# Altium schematic sheet Digital_DSP.SchDoc
size 508 x 241 mm
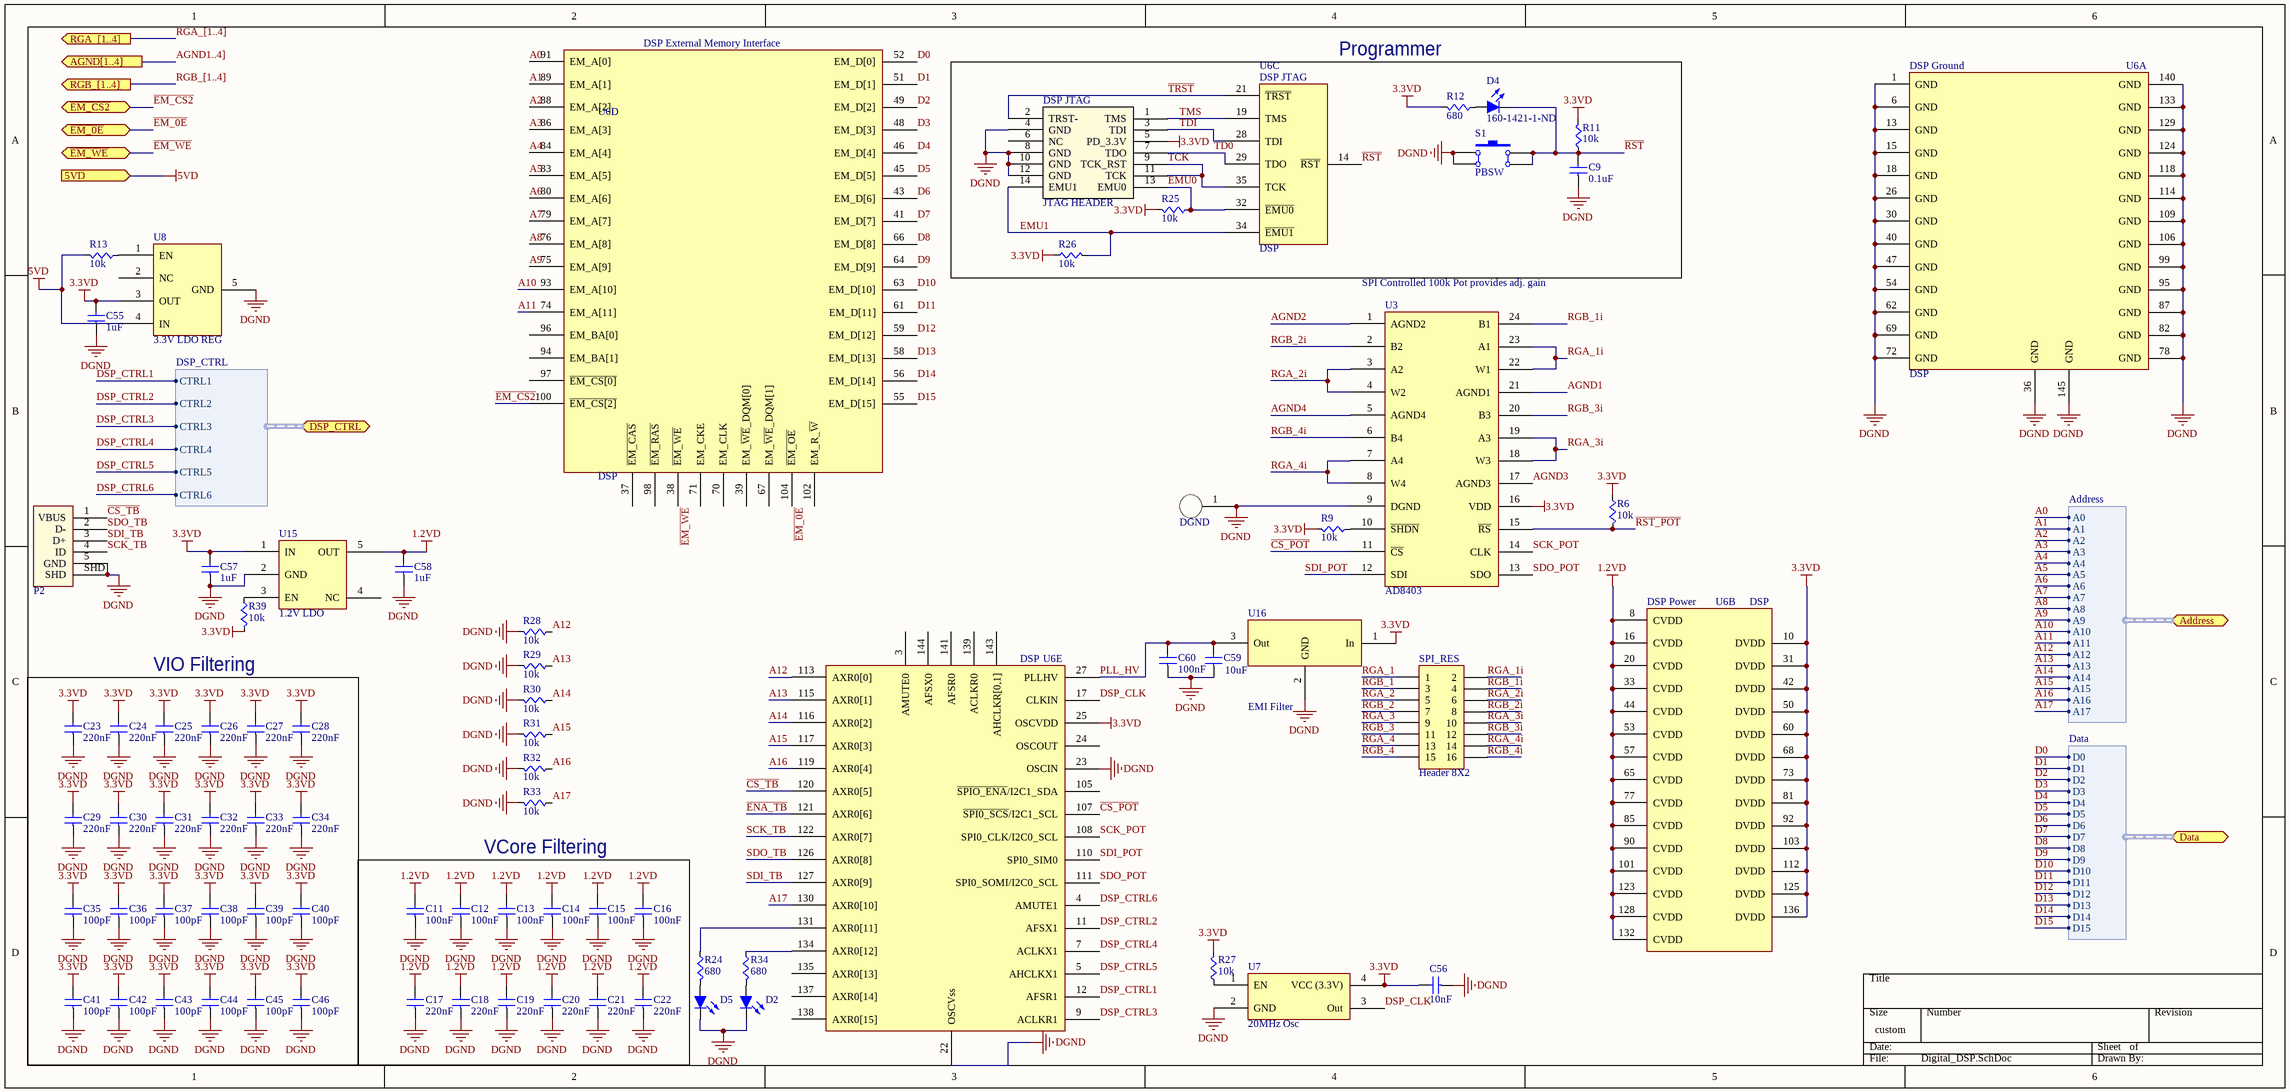
[diagram p0: Digital_DSP.SchDoc]

## Parts
C9  value 0.1uF  [CAPC0603]  (hidden comment: Cap)
C11  value 100nF  [CAPC0603]  (hidden comment: Cap)
C12  value 100nF  [CAPC0603]  (hidden comment: Cap)
C13  value 100nF  [CAPC0603]  (hidden comment: Cap)
C14  value 100nF  [CAPC0603]  (hidden comment: Cap)
C15  value 100nF  [CAPC0603]  (hidden comment: Cap)
C16  value 100nF  [CAPC0603]  (hidden comment: Cap)
C17  value 220nF  [CAPC0603]  (hidden comment: Cap)
C18  value 220nF  [CAPC0603]  (hidden comment: Cap)
C19  value 220nF  [CAPC0603]  (hidden comment: Cap)
C20  value 220nF  [CAPC0603]  (hidden comment: Cap)
C21  value 220nF  [CAPC0603]  (hidden comment: Cap)
C22  value 220nF  [CAPC0603]  (hidden comment: Cap)
C23  value 220nF  [CAPC0603]  (hidden comment: Cap)
C24  value 220nF  [CAPC0603]  (hidden comment: Cap)
C25  value 220nF  [CAPC0603]  (hidden comment: Cap)
C26  value 220nF  [CAPC0603]  (hidden comment: Cap)
C27  value 220nF  [CAPC0603]  (hidden comment: Cap)
C28  value 220nF  [CAPC0603]  (hidden comment: Cap)
C29  value 220nF  [CAPC0603]  (hidden comment: Cap)
C30  value 220nF  [CAPC0603]  (hidden comment: Cap)
C31  value 220nF  [CAPC0603]  (hidden comment: Cap)
C32  value 220nF  [CAPC0603]  (hidden comment: Cap)
C33  value 220nF  [CAPC0603]  (hidden comment: Cap)
C34  value 220nF  [CAPC0603]  (hidden comment: Cap)
C35  value 100pF  [CAPC0603]  (hidden comment: Cap)
C36  value 100pF  [CAPC0603]  (hidden comment: Cap)
C37  value 100pF  [CAPC0603]  (hidden comment: Cap)
C38  value 100pF  [CAPC0603]  (hidden comment: Cap)
C39  value 100pF  [CAPC0603]  (hidden comment: Cap)
C40  value 100pF  [CAPC0603]  (hidden comment: Cap)
C41  value 100pF  [CAPC0603]  (hidden comment: Cap)
C42  value 100pF  [CAPC0603]  (hidden comment: Cap)
C43  value 100pF  [CAPC0603]  (hidden comment: Cap)
C44  value 100pF  [CAPC0603]  (hidden comment: Cap)
C45  value 100pF  [CAPC0603]  (hidden comment: Cap)
C46  value 100pF  [CAPC0603]  (hidden comment: Cap)
C55  value 1uF  [CAPC0603]  (hidden comment: Cap1206)
C56  value 10nF  [CAPC0603]  (hidden comment: Cap)
C57  value 1uF  [CAPC0603]  (hidden comment: Cap1206)
C58  value 1uF  [CAPC0603]  (hidden comment: Cap1206)
C59  value 10uF  [CAP1210]  (hidden comment: CAP1210)
C60  value 100nF  [CAPC0603]  (hidden comment: Cap)
D2  LED-RED  [LED0805-RED]  (value not drawn)
D4  Supplier Part Number: 160-1421-1-ND  [LED0805-RED]  (hidden comment: LED-RED)
D5  LED-RED  [LED0805-RED]  (value not drawn)
DGND  Test_Point  [TP]  (value not drawn)
DSP_JTAG  JTAG HEADER  [JTAG HEADER - 14]
P2  USB Micro  [10118192-0001LF]  (value not drawn)
R6  value 10k  [RES0603]  (hidden comment: Res)
R9  value 10k  [RES0603]  (hidden comment: Res)
R11  value 10k  [RES0603]  (hidden comment: Res)
R12  value 680  [RES0603]  (hidden comment: Res)
R13  value 10k  [RES0603]  (hidden comment: Res)
R24  value 680  [RES0603]  (hidden comment: Res)
R25  value 10k  [RES0603]  (hidden comment: Res)
R26  value 10k  [RES0603]  (hidden comment: Res)
R27  value 10k  [RES0603]  (hidden comment: Res)
R28  value 10k  [RES0603]  (hidden comment: Res)
R29  value 10k  [RES0603]  (hidden comment: Res)
R30  value 10k  [RES0603]  (hidden comment: Res)
R31  value 10k  [RES0603]  (hidden comment: Res)
R32  value 10k  [RES0603]  (hidden comment: Res)
R33  value 10k  [RES0603]  (hidden comment: Res)
R34  value 680  [RES0603]  (hidden comment: Res)
R39  value 10k  [RES0603]  (hidden comment: Res)
S1  PBSW  [PBSW]
SPI_RES  Header 8X2  [HDR2X8]
U3  AD8403  [SOIC-24n]
U6  DSP  [LQFP_EP-144]  (parts A,B,C,D,E of 5)
U7  20MHz Osc  [4-SMD]
U8  3.3V LDO REG  [SOT223-8N]
U15  1.2V LDO  [sot23-5n]
U16  EMI Filter  [1812]

## Blocks framed on the sheet
Programmer: C9 D4 DSP_JTAG R11 R12 R25 R26 S1 U6
VIO Filtering: C23-C46
VCore Filtering: C11-C22

## Ports
5VD (in), Address (harness Address), AGND[1..4] (out), Data (harness Data), DSP_CTRL (harness DSP_CTRL), RGA_[1..4] (out), RGB_[1..4] (out), ~{EM_0E} (bidir), ~{EM_CS2} (bidir), ~{EM_WE} (bidir)

## Harnesses
DSP_CTRL: CTRL1, CTRL2, CTRL3, CTRL4, CTRL5, CTRL6
Address: A0, A1, A2, A3, A4, A5, A6, A7, A8, A9, A10, A11, A12, A13, A14, A15, A16, A17
Data: D0, D1, D2, D3, D4, D5, D6, D7, D8, D9, D10, D11, D12, D13, D14, D15

## Nets
1: S1.2(A')
1.2VD: C11.1(A) C12.1(A) C13.1(A) C14.1(A) C15.1(A) C16.1(A) C17.1(A) C18.1(A) C19.1(A) C20.1(A) C21.1(A) C22.1(A) C58.1(A) U6.8(CVDD) U6.16(CVDD) U6.20(CVDD) U6.33(CVDD) U6.44(CVDD) U6.53(CVDD) U6.57(CVDD) U6.65(CVDD) U6.77(CVDD) U6.85(CVDD) U6.90(CVDD) U6.101(CVDD) U6.123(CVDD) U6.128(CVDD) U6.132(CVDD) U15.5(OUT)
3: S1.4(B')
3.3VD: C23.1(A) C24.1(A) C25.1(A) C26.1(A) C27.1(A) C28.1(A) C29.1(A) C30.1(A) C31.1(A) C32.1(A) C33.1(A) C34.1(A) C35.1(A) C36.1(A) C37.1(A) C38.1(A) C39.1(A) C40.1(A) C41.1(A) C42.1(A) C43.1(A) C44.1(A) C45.1(A) C46.1(A) C55.1(A) C56.1(A) C57.1(A) DSP_JTAG.5(PD_3.3V) R6.2(B) R9.1(A) R11.1(A) R12.1(A) R25.1(A) R26.2(B) R27.1(A) R39.1(A) U3.16(VDD) U6.10(DVDD) U6.25(OSCVDD) U6.31(DVDD) U6.42(DVDD) U6.50(DVDD) U6.60(DVDD) U6.68(DVDD) U6.73(DVDD) U6.81(DVDD) U6.92(DVDD) U6.103(DVDD) U6.112(DVDD) U6.125(DVDD) U6.136(DVDD) U7.4(VCC_(3.3V)) U8.3(OUT) U15.1(IN) U16.1(In)
5VD: R13.1(A) U8.4(IN) ; port 5VD
DGND: C9.2(B) C11.2(B) C12.2(B) C13.2(B) C14.2(B) C15.2(B) C16.2(B) C17.2(B) C18.2(B) C19.2(B) C20.2(B) C21.2(B) C22.2(B) C23.2(B) C24.2(B) C25.2(B) C26.2(B) C27.2(B) C28.2(B) C29.2(B) C30.2(B) C31.2(B) C32.2(B) C33.2(B) C34.2(B) C35.2(B) C36.2(B) C37.2(B) C38.2(B) C39.2(B) C40.2(B) C41.2(B) C42.2(B) C43.2(B) C44.2(B) C45.2(B) C46.2(B) C55.2(B) C56.2(B) C57.2(B) C58.2(B) C59.2(B) C60.2(B) D2.1(K) D5.1(K) DGND.1 DSP_JTAG.4(GND) DSP_JTAG.8(GND) DSP_JTAG.10(GND) DSP_JTAG.12(GND) P2.5(GND) P2.SHD R28.1(A) R29.1(A) R30.1(A) R31.1(A) R32.1(A) R33.1(A) S1.1(A) S1.2(A') U3.9(DGND) U6.1(GND) U6.6(GND) U6.13(GND) U6.15(GND) U6.18(GND) U6.22(OSCVss) U6.23(OSCIN) U6.26(GND) U6.30(GND) U6.36(GND) U6.40(GND) U6.47(GND) U6.54(GND) U6.62(GND) U6.69(GND) U6.72(GND) U6.78(GND) U6.82(GND) U6.87(GND) U6.95(GND) U6.99(GND) U6.106(GND) U6.109(GND) U6.114(GND) U6.118(GND) U6.124(GND) U6.129(GND) U6.133(GND) U6.140(GND) U6.145(GND) U7.2(GND) U8.5(GND) U15.2(GND) U16.2(GND)
A0: U6.91(EM_A[0]) ; port Address.A0
A1: U6.89(EM_A[1]) ; port Address.A1
A2: U6.88(EM_A[2]) ; port Address.A2
A3: U6.86(EM_A[3]) ; port Address.A3
A4: U6.84(EM_A[4]) ; port Address.A4
A5: U6.83(EM_A[5]) ; port Address.A5
A6: U6.80(EM_A[6]) ; port Address.A6
A7: U6.79(EM_A[7]) ; port Address.A7
A8: U6.76(EM_A[8]) ; port Address.A8
A9: U6.75(EM_A[9]) ; port Address.A9
A10: U6.93(EM_A[10]) ; port Address.A10
A11: U6.74(EM_A[11]) ; port Address.A11
A12: R28.2(B) U6.113(AXR0[0]) ; port Address.A12
A13: R29.2(B) U6.115(AXR0[1]) ; port Address.A13
A14: R30.2(B) U6.116(AXR0[2]) ; port Address.A14
A15: R31.2(B) U6.117(AXR0[3]) ; port Address.A15
A16: R32.2(B) U6.119(AXR0[4]) ; port Address.A16
A17: R33.2(B) U6.130(AXR0[10]) ; port Address.A17
AGND1: U3.21(AGND1)
AGND2: U3.1(AGND2)
AGND3: U3.17(AGND3)
AGND4: U3.5(AGND4)
~{CS_POT}: U3.11(~{CS}) U6.107(~{SPI0_SCS}/I2C1_SCL)
~{CS_TB}: P2.1(VBUS) U6.120(AXR0[5])
D0: U6.52(EM_D[0]) ; port Data.D0
D1: U6.51(EM_D[1]) ; port Data.D1
D2: U6.49(EM_D[2]) ; port Data.D2
D3: U6.48(EM_D[3]) ; port Data.D3
D4: U6.46(EM_D[4]) ; port Data.D4
D5: U6.45(EM_D[5]) ; port Data.D5
D6: U6.43(EM_D[6]) ; port Data.D6
D7: U6.41(EM_D[7]) ; port Data.D7
D8: U6.66(EM_D[8]) ; port Data.D8
D9: U6.64(EM_D[9]) ; port Data.D9
D10: U6.63(EM_D[10]) ; port Data.D10
D11: U6.61(EM_D[11]) ; port Data.D11
D12: U6.59(EM_D[12]) ; port Data.D12
D13: U6.58(EM_D[13]) ; port Data.D13
D14: U6.56(EM_D[14]) ; port Data.D14
D15: U6.55(EM_D[15]) ; port Data.D15
DSP_CLK: U6.17(CLKIN) U7.3(Out)
DSP_CTRL1: U6.12(AFSR1) ; port DSP_CTRL.CTRL1
DSP_CTRL2: U6.11(AFSX1) ; port DSP_CTRL.CTRL2
DSP_CTRL3: U6.9(ACLKR1) ; port DSP_CTRL.CTRL3
DSP_CTRL4: U6.7(ACLKX1) ; port DSP_CTRL.CTRL4
DSP_CTRL5: U6.5(AHCLKX1) ; port DSP_CTRL.CTRL5
DSP_CTRL6: U6.4(AMUTE1) ; port DSP_CTRL.CTRL6
~{EM_0E}: U6.104(~{EM_OE}) ; port ~{EM_0E}
~{EM_CS2}: U6.100(~{EM_CS[2]}) ; port ~{EM_CS2}
~{EM_WE}: U6.38(~{EM_WE}) ; port ~{EM_WE}
~{ENA_TB}: U6.121(AXR0[6])
EMU0: DSP_JTAG.13(EMU0) R25.2(B) U6.32(~{EMU0})
EMU1: DSP_JTAG.14(EMU1) R26.1(A) U6.34(~{EMU1})
PLL_HV: C59.1(A) C60.1(A) U6.27(PLLHV) U16.3(Out)
~{RST}: C9.1(A) D4.1(K) R11.2(B) S1.3(B) S1.4(B') U6.14(~{RST})
~{RST_POT}: R6.1(A) U3.15(~{RS})
RGA_1: SPI_RES.1
RGA_1i: SPI_RES.2 U3.22(W1) U3.23(A1)
RGA_2: SPI_RES.5
RGA_2i: SPI_RES.6 U3.3(A2) U3.4(W2)
RGA_3: SPI_RES.9
RGA_3i: SPI_RES.10 U3.18(W3) U3.19(A3)
RGA_4: SPI_RES.13
RGA_4i: SPI_RES.14 U3.7(A4) U3.8(W4)
RGB_1: SPI_RES.3
RGB_1i: SPI_RES.4 U3.24(B1)
RGB_2: SPI_RES.7
RGB_2i: SPI_RES.8 U3.2(B2)
RGB_3: SPI_RES.11
RGB_3i: SPI_RES.12 U3.20(B3)
RGB_4: SPI_RES.15
RGB_4i: SPI_RES.16 U3.6(B4)
SCK_POT: U3.14(CLK) U6.108(SPI0_CLK/I2C0_SCL)
SCK_TB: P2.4(ID) U6.122(AXR0[7])
SDI_POT: U3.12(SDI) U6.110(SPI0_SIM0)
SDI_TB: P2.3(D+) U6.127(AXR0[9])
SDO_POT: U3.13(SDO) U6.111(SPI0_SOMI/I2C0_SCL)
SDO_TB: P2.2(D-) U6.126(AXR0[8])
~{TRST}: DSP_JTAG.2(TRST-) U6.21(~{TRST})
TCK: DSP_JTAG.9(TCK_RST) DSP_JTAG.11(TCK) U6.35(TCK)
TD0: DSP_JTAG.7(TDO) U6.29(TDO)
TDI: DSP_JTAG.3(TDI) U6.28(TDI)
TMS: DSP_JTAG.1(TMS) U6.19(TMS)
NetD2_2: D2.2(A) R34.1(A)
NetD4_2: D4.2(A) R12.2(B)
NetD5_2: D5.2(A) R24.1(A)
NetR9_2: R9.2(B) U3.10(~{SHDN})
NetR13_2: R13.2(B) U8.1(EN)
NetR24_2: R24.2(B) U6.131(AXR0[11])
NetR27_2: R27.2(B) U7.1(EN)
NetR34_2: R34.2(B) U6.134(AXR0[12])
NetR39_2: R39.2(B) U15.3(EN)

Not connected (* = marked no-connect by the designer): DSP_JTAG 6(NC); U6 3(AMUTE0) 24(OSCOUT) 37(~{EM_CAS}) 39(EM_~{WE}_DQM[0]) 67(EM_~{WE}_DQM[1]) 70(EM_CLK) 71(EM_CKE) 94(EM_BA[1]) 96(EM_BA[0]) 97(~{EM_CS[0]}) 98(~{EM_RAS}) 102(EM_R_~{W}) 105(~{SPIO_ENA}/I2C1_SDA) 135(AXR0[13]) 137(AXR0[14]) 138(AXR0[15]) 139(ACLKR0) 141(AFSR0) 143(AHCLKR[0,1]) 144(AFSX0); U8 2(NC); U15 4(NC)

## Buses and harness runs
bus AGND1..4] = port AGND[1..4]
bus RGA_[1..4] = port RGA_[1..4]
bus RGB_[1..4] = port RGB_[1..4]

## Notes on the sheet
- (near U3) SPI Controlled 100k Pot provides adj. gain
- (in symbol TMS320C6726B, part A) DSP Ground
- (in symbol TMS320C6726B, part B) DSP Power
- (in symbol TMS320C6726B, part C) DSP JTAG
- (in symbol TMS320C6726B, part D) DSP External Memory Interface

## Library data of the parts
C55 C57 C58 = Cap1206: CAP CER 1UF 50V 10% X7R 1206; Supplier 1: Digi-Key; Supplier Part Number 1: 587-2230-1-ND
C59 = CAP1210: CAP CER 10UF 50V 20% X5R 1210; Supplier 1: Digi-Key; Supplier Part Number 1: 587-2225-1-ND
D2 D4 D5 = LED-RED: Light Emitting Diode - RED; Manufacturer Part Number: LTST-C171CKT; Manufacturer: Lite-On Inc; Voltage - Forward (Vf) Typ: 1.8V; Current - Test: 20mA; Millicandela Rating: 25mcd; Viewing Angle: 130°; Color: Red; Supplier: Digi-Key; Package / Case: 0805 (2012 Metric)
  D2 D5: Supplier Part Number: 160-1421-1-ND
DGND = Test_Point: TEST POINT PC COMPACT .063"D; Supplier 1: Digi-Key; Supplier Part Number 1: 5006K-ND
DSP_JTAG = JTAG-TI_14: 14 Pin JTAG Header
P2 = USB Micro: USB Mini B Metal Shield SMT; Supplier 1: Digi-Key; Supplier Part Number 1: 609-4613-1-ND
S1 = SW-PB: Push Button Switch; Manufacturer: Panasonic Electronic Components; Manufacturer Part Number: EVQ-9P105M; Outline: 6.10mm x 6.00mm; Actuator Orientation: Top Actuated; Actuator Height off PCB, from Pins: 5.00mm; Published: 24-Mar-1999; LatestRevisionDate: 17-Jul-2002; LatestRevisionNote: Re-released for DXP Platform.; PackageReference: SPST-2; Publisher: Altium Limited; PackageDescription: Switch; 2 Leads; Supplier: Digi-Key; Supplier Part Number: P13586SCT-ND
SPI_RES = Header 8X2: Header, 8-Pin, Dual row; LatestRevisionDate: 17-Jul-2002; LatestRevisionNote: Re-released for DXP Platform.; Publisher: Altium Limited
U3 = AD8403: IC POT DGTL 8BIT 100K 4CH 24SOIC; Supplier 1: Digi-Key; Supplier Part Number 1: AD8403ARZ100-ND
U6 = TMS320C6726B: IC FLOATING POINT DSP 144-HTQFP; Supplier 1: Digi-Key; Supplier Part Number 1: 296-26845-ND
U7 = CB3LV-3C-20M0000: OSC XO 20.000MHZ HCMOS TTL SMD; Supplier Part Number 1: CTX273LVCT-ND; Supplier 1: Digi-Key
U8 = LP38691: IC REG LDO 3.3V 0.5A SOT223-5; Supplier 1: Digi-Key; Supplier Part Number 1: LP38693MP-3.3/NOPBCT-ND
U15 = LP3990MF-1.2: IC REG LDO 1.2V 0.15A SOT23-5; Supplier 1: Digi-Key; Supplier Part Number 1: LP3990MF-1.2/NOPBCT-ND
U16 = ACF451832-333: FILTER 3-TERM 12MHZ 300MA SMD; Supplier 1: Digi-Key; Supplier Part Number 1: 445-2077-1-ND
C9 C11-C46 C56 C60 = Cap: Supplier 1: Digi-Key; Supplier Part Number 1: 1276-1000-1-ND
R6 R9 R11-R13 R24-R34 R39 = Res: Supplier 1: Digi-Key; Supplier Part Number 1: RMCF0603JT10K0CT-ND